# EAGLE design netCPU breakout (EAGLE 6.3)
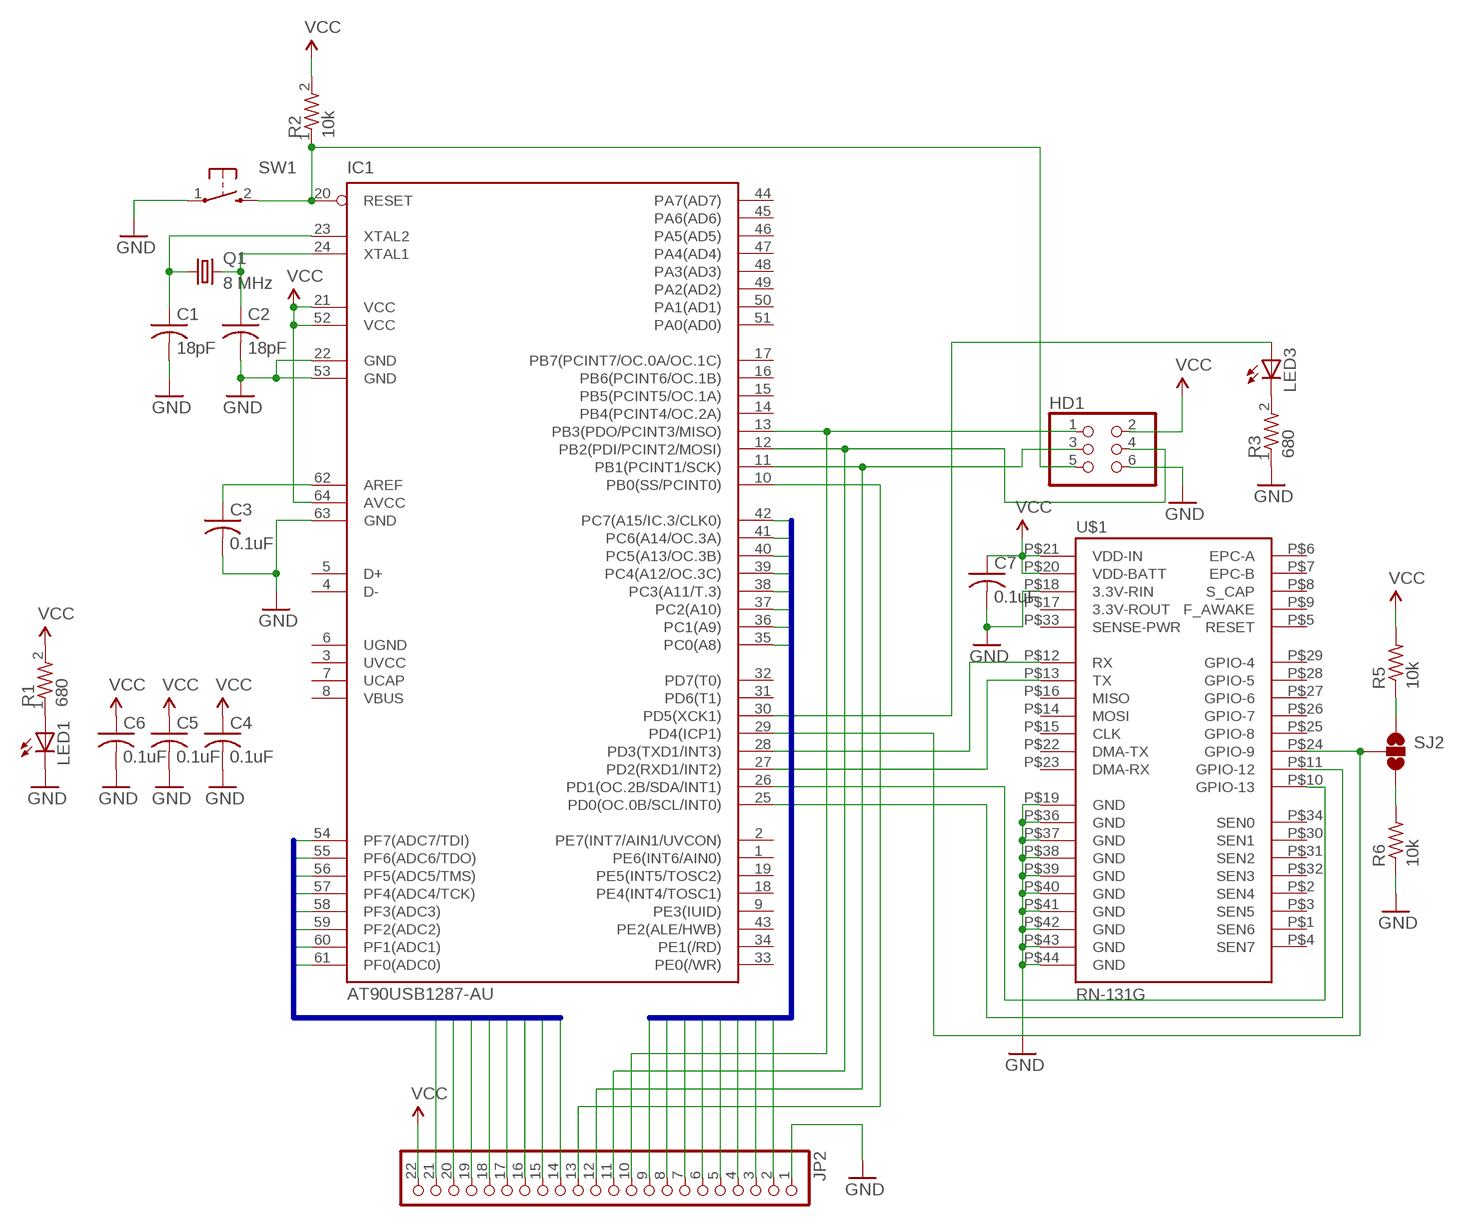
[diagram p0: schematic, sheet 1]

## Parts
C1  18pF  C-USC0603K  [C0603K]
C2  18pF  C-USC0603K  [C0603K]
C3  0.1uF  C-USC0603K  [C0603K]
C4  0.1uF  C-USC0603K  [C0603K]
C5  0.1uF  C-USC0603K  [C0603K]
C6  0.1uF  C-USC0603K  [C0603K]
C7  0.1uF  C-USC0603K  [C0603K]
HD1  HEADER2X3  [HEADER2X3]
IC1  AT90USB1287-AU  [TQFP64]
JP2  PINHD-1X22  [1X22]
LED1  LEDCHIP-LED0603  [CHIP-LED0603]
LED3  LEDCHIP-LED0603  [CHIP-LED0603]
Q1  8 MHz  CRYSTALHC49UP  [HC49UP]
R1  680  0603_RESISTOR  [0603_RESISTOR]
R2  10k  0603_RESISTOR  [0603_RESISTOR]
R3  680  0603_RESISTOR  [0603_RESISTOR]
R5  10k  R-US_R0603  [R0603]
R6  10k  R-US_R0603  [R0603]
SJ2  SOLDERJUMPER_2WAYPASTE2&3  [SJ_3_PASTE2&3]
SW1  TAC-SWITCH  [TAC-SWITCH]
U$1  RN-131G  [RN-131G]

## Nets
GND: C1.2 C2.2 C3.2 C4.2 C5.2 C6.2 C7.2 HD1.6 IC1.22(GND) IC1.53(GND) IC1.63(GND) JP2.1 LED1.C R3.1 R6.1 SW1.1 U$1.P$18(3.3V-RIN) U$1.P$19(GND) U$1.P$36(GND) U$1.P$37(GND) U$1.P$38(GND) U$1.P$39(GND) U$1.P$40(GND) U$1.P$41(GND) U$1.P$42(GND) U$1.P$43(GND) U$1.P$44(GND)
MISO: HD1.1 IC1.13(PB3(PDO/PCINT3/MISO)) JP2.10
MOSI: HD1.4 IC1.12(PB2(PDI/PCINT2/MOSI)) JP2.11
N$1: C1.1 IC1.23(XTAL2) Q1.1
N$2: C2.1 IC1.24(XTAL1) Q1.2
N$3: LED1.A R1.1
N$4: LED3.C R3.2
N$6: IC1.28(PD3(TXD1/INT3)) U$1.P$12(RX)
N$8: C3.1 IC1.62(AREF)
N$9: IC1.27(PD2(RXD1/INT2)) U$1.P$13(TX)
N$10: IC1.26(PD1(OC.2B/SDA/INT1)) U$1.P$10(GPIO-13)
N$11: IC1.25(PD0(OC.0B/SCL/INT0)) U$1.P$11(GPIO-12)
N$13: IC1.29(PD4(ICP1)) SJ2.2 U$1.P$24(GPIO-9)
N$15: IC1.30(PD5(XCK1)) LED3.A
N$17: R6.2 SJ2.3
N$18: R5.1 SJ2.1
PC0: IC1.35(PC0(A8)) JP2.2
PC1: IC1.36(PC1(A9)) JP2.3
PC2: IC1.37(PC2(A10)) JP2.4
PC3: IC1.38(PC3(A11/T.3)) JP2.5
PC4: IC1.39(PC4(A12/OC.3C)) JP2.6
PC5: IC1.40(PC5(A13/OC.3B)) JP2.7
PC6: IC1.41(PC6(A14/OC.3A)) JP2.8
PC7: IC1.42(PC7(A15/IC.3/CLK0)) JP2.9
PF0: IC1.61(PF0(ADC0)) JP2.14
PF1: IC1.60(PF1(ADC1)) JP2.15
PF2: IC1.59(PF2(ADC2)) JP2.16
PF3: IC1.58(PF3(ADC3)) JP2.17
PF4: IC1.57(PF4(ADC4/TCK)) JP2.18
PF5: IC1.56(PF5(ADC5/TMS)) JP2.19
PF6: IC1.55(PF6(ADC6/TDO)) JP2.20
PF7: IC1.54(PF7(ADC7/TDI)) JP2.21
RESET: HD1.5 IC1.20(RESET) R2.1 SW1.2
SCK: HD1.3 IC1.11(PB1(PCINT1/SCK)) JP2.12
SS: IC1.10(PB0(SS/PCINT0)) JP2.13
VCC: C4.1 C5.1 C6.1 C7.1 HD1.2 IC1.21(VCC) IC1.52(VCC) IC1.64(AVCC) JP2.22 R1.2 R2.2 R5.2 U$1.P$20(VDD-BATT) U$1.P$21(VDD-IN)
Unconnected: IC1.1(PE6(INT6/AIN0)) IC1.2(PE7(INT7/AIN1/UVCON)) IC1.4(D-) IC1.5(D+) IC1.9(PE3(IUID)) IC1.14(PB4(PCINT4/OC.2A)) IC1.15(PB5(PCINT5/OC.1A)) IC1.16(PB6(PCINT6/OC.1B)) IC1.17(PB7(PCINT7/OC.0A/OC.1C)) IC1.18(PE4(INT4/TOSC1)) IC1.19(PE5(INT5/TOSC2)) IC1.31(PD6(T1)) IC1.32(PD7(T0)) IC1.33(PE0(/WR)) IC1.34(PE1(/RD)) IC1.43(PE2(ALE/HWB)) IC1.44(PA7(AD7)) IC1.45(PA6(AD6)) IC1.46(PA5(AD5)) IC1.47(PA4(AD4)) IC1.48(PA3(AD3)) IC1.49(PA2(AD2)) IC1.50(PA1(AD1)) IC1.51(PA0(AD0)) U$1.P$1(SEN6) U$1.P$2(SEN4) U$1.P$3(SEN5) U$1.P$4(SEN7) U$1.P$5(RESET) U$1.P$6(EPC-A) U$1.P$7(EPC-B) U$1.P$8(S_CAP) U$1.P$9(F_AWAKE) U$1.P$14(MOSI) U$1.P$15(CLK) U$1.P$16(MISO) U$1.P$17(3.3V-ROUT) U$1.P$22(DMA-TX) U$1.P$23(DMA-RX) U$1.P$25(GPIO-8) U$1.P$26(GPIO-7) U$1.P$27(GPIO-6) U$1.P$28(GPIO-5) U$1.P$29(GPIO-4) U$1.P$30(SEN1) U$1.P$31(SEN2) U$1.P$32(SEN3) U$1.P$33(SENSE-PWR) U$1.P$34(SEN0)

## Buses
PF[0..7]
PC[0..7]

## Power pins joined to a net without a drawn wire
UCAP: IC1.7(UCAP)
UGND: IC1.6(UGND)
UVCC: IC1.3(UVCC)
VBUS: IC1.8(VBUS)

## Library data of the parts
C1-C7 = rcl:C-US: CAPACITOR, American symbol
HD1 = jkf-parts:HEADER2X3
IC1 = at90usb:AT90USB1287-*: Atmel AT90USB1287 AVR Microcontroller with USB Interface and 128kB Flash Memory
JP2 = pinhead:PINHD-1X22: PIN HEADER
LED1 LED3 = adafruit:LED: LED OSRAM: - CHIPLED LG R971, LG N971, LY N971, LG Q971, LY Q971, LO R971, LY R971 LH N974, LH R974 LS Q976, LO Q976, LY Q976 LO Q996 - Hyper CHIPLED LW Q18S LB Q993, LB Q99A, LB R99A - SideLED LS A670, LO A670, LY A670, LG A670, LP A670 LB A673, LV A673, LT A673, LW A673 LH A674 LY A675 LS A676, LA A676, LO A676, LY A676, LW A676 LS A679, LY A679, LG A679 - Hyper Micro SIDELED® LS Y876, LA Y876, LO Y876, LY Y876 LT Y87S - SmartLED LW L88C, LW L88S LB L89C, LB L89S, LG L890 LS L89K, LO L89K, LY L89K LS L896, LA L896, LO L896, LY L896 - TOPLED LS T670, LO T670, LY T670, LG T670, LP T670 LSG T670, LSP T670, LSY T670, LOP T670, LYG T670 LG T671, LOG T671, LSG T671 LB T673, LV T673, LT T673, LW T673 LH T674 LS T676, LA T676, LO T676, LY T676, LB T676, LH T676, LSB T676, LW T676 LB T67C, LV T67C, LT T67C, LS T67K, LO T67K, LY T67K, LW E67C LS E67B, LA E67B, LO E67B, LY E67B, LB E67C, LV E67C, LT E67C LW T67C LS T679, LY T679, LG T679 LS T770, LO T770, LY T770, LG T770, LP T770 LB T773, LV T773, LT T773, LW T773 LH T774 LS E675, LA E675, LY E675, LS T675 LS T776, LA T776, LO T776, LY T776, LB T776 LHGB T686 LT T68C, LB T68C - Hyper Mini TOPLED® LB M676 - Mini TOPLED Santana® LG M470 LS M47K, LO M47K, LY M47K Source: http://www.osram.convergy.de/
Q1 = crystal:CRYSTAL: CRYSTAL; OC_FARNELL: unknown; OC_NEWARK: unknown
R1-R3 = jkf-parts:0603_RESISTOR
R5 R6 = resistor:R-US_: RESISTOR, American symbol
SJ2 = SparkFun-Passives:SOLDERJUMPER_2WAY: Solder Jumper 2 way solder jumper
SW1 = jkf-parts:TAC-SWITCH
U$1 = SparkFun-RF:RN-131G: Roving Netowrks WiFLy GSX Module

## Board
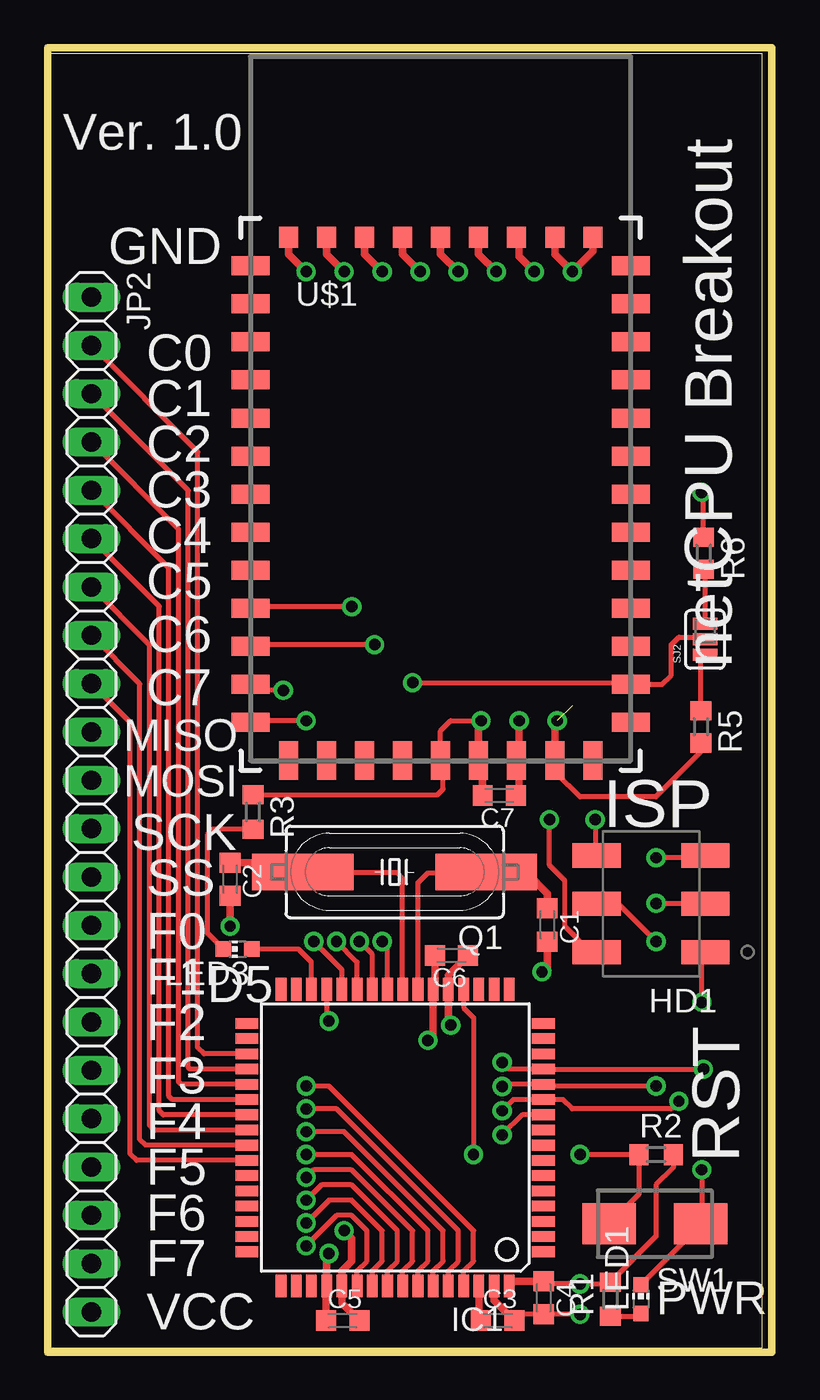
[diagram p1: board, top side]
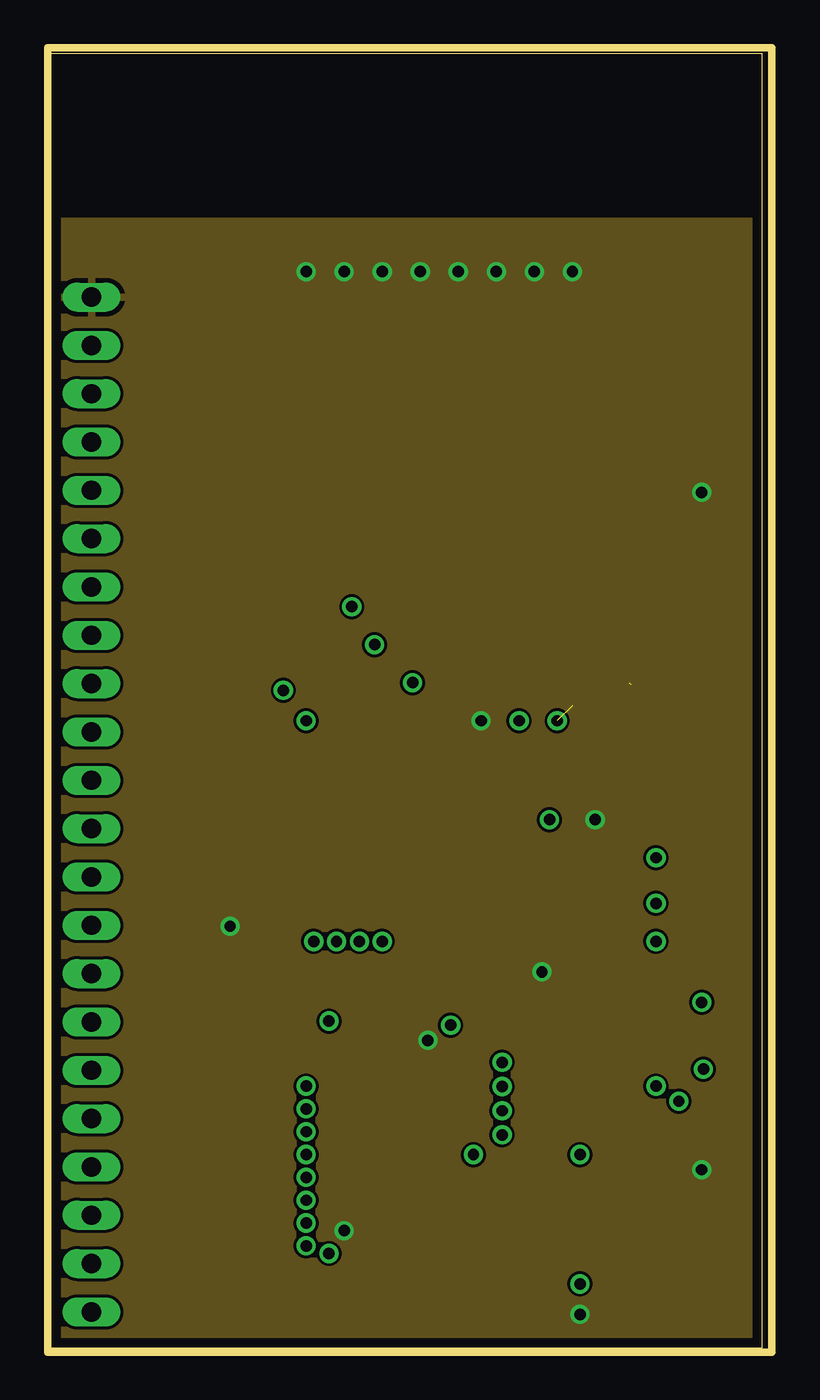
[diagram p2: board, inner layer GND]
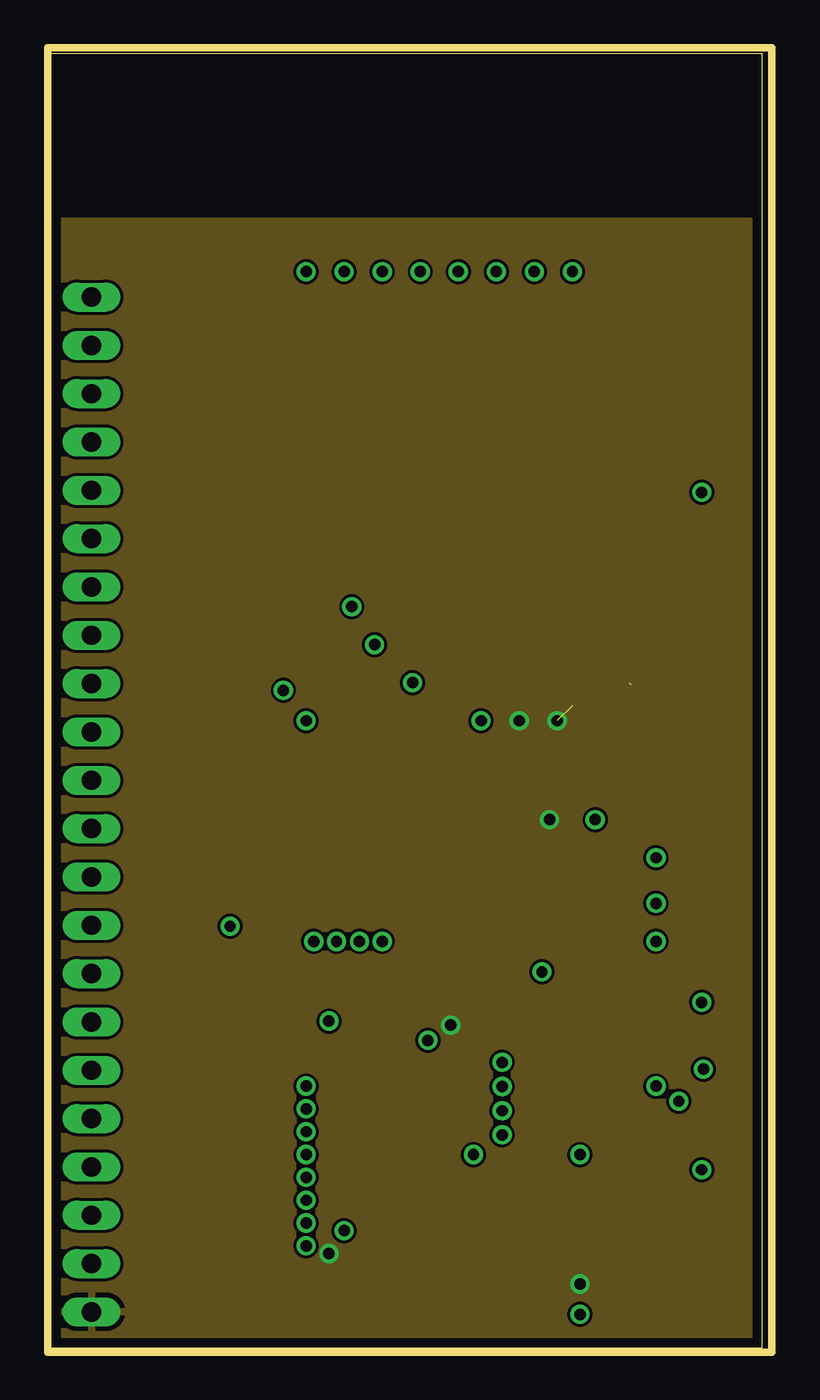
[diagram p3: board, inner layer VCC]
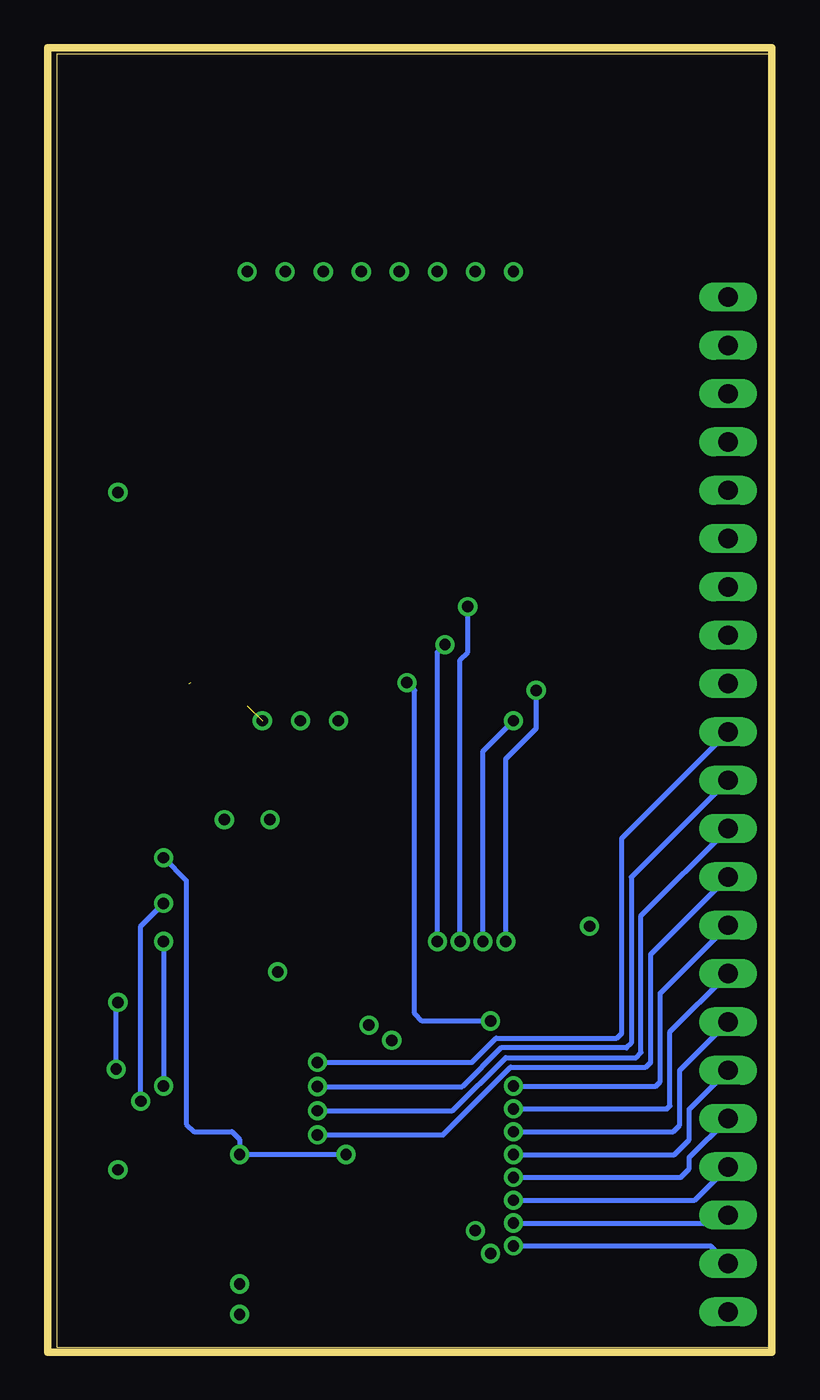
[diagram p4: board, bottom side, seen from below]

Size 38.1 x 68.58 mm. Coordinates in mm from the lower left corner, seen from the top.
Outline: 0.09,0.25 37.6,0.25 37.6,68.25 0.09,68.25 0.09,0.25
Outline: 0,68.58 38.1,68.58 38.1,0 0,0 0,68.58
Copper layers (1+2*15+16): Top 0.0178mm / dielectric 12mil / GND 0.0356mm / dielectric 28mil / VCC 0.0356mm / dielectric 12mil / Bottom 0.0178mm
Design rules "SSC-EAGLE-4Lyr_v1.0.0.3 *": minimum track width 6mil, minimum drill 8mil, track to track 6mil, track to pad 6mil, pad to pad 6mil, via to via 6mil, smd to smd 6mil, copper to edge 20mil, drill to drill 16mil, minimum pad ring 8mil, minimum via ring 8mil, stop-mask expansion 3mil, vias tented up to drill 0mil, thermal gap 10mil
tKeepout: area 14.5,32.9 to 16.7,35.1; area 23.3,38.1 to 25.5,40.3

### Footprints (pad centres in the part's own frame; a part is rotated, then mirrored left to right if it is on the bottom)
C0603K = smd 1.05 x 1.08: 1 -0.875,0; 2 0.875,0
HEADER2X3 = smd 2.54 x 1.27: 1 -3.175,2.54; 2 2.54,2.54; 3 -3.175,0; 4 2.54,0; 5 -3.175,-2.54; 6 2.54,-2.54
TQFP64 = smd 1.194 x 0.559: 1 -7.8,6; 2 -7.8,5.2; 3 -7.8,4.4; 4 -7.8,3.6; 5 -7.8,2.8; 6 -7.8,2; 7 -7.8,1.2; 8 -7.8,0.4; 9 -7.8,-0.4; 10 -7.8,-1.2; 11 -7.8,-2; 12 -7.8,-2.8; 13 -7.8,-3.6; 14 -7.8,-4.4; 15 -7.8,-5.2; 16 -7.8,-6; 33 7.8,-6; 34 7.8,-5.2; 35 7.8,-4.4; 36 7.8,-3.6; 37 7.8,-2.8; 38 7.8,-2; 39 7.8,-1.2; 40 7.8,-0.4; 41 7.8,0.4; 42 7.8,1.2; 43 7.8,2; 44 7.8,2.8; 45 7.8,3.6; 46 7.8,4.4; 47 7.8,5.2; 48 7.8,6 | smd 0.559 x 1.194: 17 -6,-7.8; 18 -5.2,-7.8; 19 -4.4,-7.8; 20 -3.6,-7.8; 21 -2.8,-7.8; 22 -2,-7.8; 23 -1.2,-7.8; 24 -0.4,-7.8; 25 0.4,-7.8; 26 1.2,-7.8; 27 2,-7.8; 28 2.8,-7.8; 29 3.6,-7.8; 30 4.4,-7.8; 31 5.2,-7.8; 32 6,-7.8; 49 6,7.8; 50 5.2,7.8; 51 4.4,7.8; 52 3.6,7.8; 53 2.8,7.8; 54 2,7.8; 55 1.2,7.8; 56 0.4,7.8; 57 -0.4,7.8; 58 -1.2,7.8; 59 -2,7.8; 60 -2.8,7.8; 61 -3.6,7.8; 62 -4.4,7.8; 63 -5.2,7.8; 64 -6,7.8
1X22 = drill 1.016 long: 1 -26.67,0; 2 -24.13,0; 3 -21.59,0; 4 -19.05,0; 5 -16.51,0; 6 -13.97,0; 7 -11.43,0; 8 -8.89,0; 9 -6.35,0; 10 -3.81,0; 11 -1.27,0; 12 1.27,0; 13 3.81,0; 14 6.35,0; 15 8.89,0; 16 11.43,0; 17 13.97,0; 18 16.51,0; 19 19.05,0; 20 21.59,0; 21 24.13,0; 22 26.67,0
CHIP-LED0603 = smd 0.8 x 0.8: A 0,-0.75; C 0,0.75
HC49UP = smd 5.334 x 1.93: 1 -4.826,0; 2 4.826,0
0603_RESISTOR = smd 1 x 1.1: 1 -0.9,0; 2 0.9,0
R0603 = smd 1 x 1.1: 1 -0.85,0; 2 0.85,0
SJ_3_PASTE2&3 = smd 0.635 x 1.27: 1 -0.813,0; 2 0,0; 3 0.813,0
TAC-SWITCH = smd 2.8 x 2.16: 1 1.4,1.08; 2 6.2,1.08
RN-131G = smd 2 x 1: P$1 -10,11; P$2 -10,9; P$3 -10,7; P$4 -10,5; P$5 -10,3; P$6 -10,1; P$7 -10,-1; P$8 -10,-3; P$9 -10,-5; P$10 -10,-7; P$11 -10,-9; P$12 -10,-11; P$13 -10,-13; P$23 10,-13; P$24 10,-11; P$25 10,-9; P$26 10,-7; P$27 10,-5; P$28 10,-3; P$29 10,-1; P$30 10,1; P$31 10,3; P$32 10,5; P$33 10,7; P$34 10,9; P$35 10,11 | smd 1 x 2: P$14 -8,-15; P$15 -6,-15; P$16 -4,-15; P$17 -2,-15; P$18 0,-15; P$19 2,-15; P$20 4,-15; P$21 6,-15; P$22 8,-15 | smd 1 x 1.11: P$36 8,12.492; P$37 6,12.492; P$38 4,12.492; P$39 2,12.492; P$40 0,12.492; P$41 -2,12.492; P$42 -4,12.492; P$43 -6,12.492; P$44 -8,12.492

### Placement (x,y rotation side)
C1  26.28,22.47 270 top
C2  9.6,24.87 270 top
C3  23.68,1.67 0 top
C4  26.09,2.87 270 top
C5  15.52,1.67 0 top
C6  21.24,20.87 180 top
C7  23.76,29.27 180 top
HD1  31.42,23.58 180 top
IC1  18.28,11.29 180 top
JP2  2.31,28.8 270 top
LED1  31.2,2.8 0 top
LED3  10,21.2 90 top
Q1  18.25,25.25 180 top
R1  29.6,2.8 90 top
R2  32,10.4 0 top
R3  10.8,28.4 270 top
R5  34.36,32.88 270 top
R6  34.5,42 270 top
SJ2  34.58,37.48 90 top
SW1  35.74,7.84 180 top
U$1  20.67,46.11 0 top

### Tracks (layer width: path | path; a pad name or v marks a point on that pad's centre or on a via)
GND  (via drill 0.6, 0.6 pad 0.25)
  Top 0.254: v34.4,9.6 34.4,6.82 SW1.1 34.34,6.69 LED1.C | v28.8,28 28.8,26.2 HD1.6 | v22.8,33.2 21.2,33.2 20.67,32.67 U$1.P$18 20.8,30.98 20.8,29.6 20.5,29.3 R3.1 | 24.89,2 24.89,1.31 | v28,2 C4.2 24.88,2 C3.2 | R6.1 34.5,45.1 v34.4,45.2
  Top 0.406: U$1.P$44 12.67,57.73 v13.6,56.8 | U$1.P$43 14.67,57.73 v15.6,56.8 | U$1.P$42 16.67,57.73 v17.6,56.8 | U$1.P$41 18.67,57.73 v19.6,56.8 | U$1.P$40 20.67,57.73 v21.6,56.8 | U$1.P$39 22.67,57.73 v23.6,56.8 | U$1.P$38 24.67,58.53 24.8,58.4 24.8,57.6 v25.6,56.8 | U$1.P$36 28.67,57.87 v27.6,56.8 26.67,57.73 U$1.P$37 | v22.8,33.2 22.67,33.07 U$1.P$19 22.89,30.89 C7.2 | C2.2 v9.6,22.4 | v15.6,6.4 16,6 16,4.8 15.48,4.28 IC1.53 15.48,2.58 C5.2 | 24.89,2 C3.2 23.48,2.75 IC1.63 | C6.2 20.36,19.18 IC1.22 20.28,16.68 v20,16.4 | C1.2 26.28,20.28 v26,20
  pour GND: 0.09,59.45 37.56,59.45 37.56,0.25 0.09,0.25
MISO  (via drill 0.6 pad 0.25, 0.6 pad 0.41)
  Top 0.254: v34.49,14.89 IC1.13 24.26,14.89 v23.91,15.24 | 34.4,20.84 HD1.1 34.59,21 34.4,20.8 v34.4,18.4
  Bottom 0.254: v34.49,14.89 34.49,18.31 v34.4,18.4 | v23.91,15.24 15.78,15.24 14.51,16.51 8.16,16.51 7.91,16.77 7.91,27.02 JP2.10
MOSI  (via drill 0.6 pad 0.25, 0.6 pad 0.41)
  Top 0.254: 28.9,23.6 HD1.4 30.02,23.58 v32,21.6 | v32,14 26.17,14 IC1.12 | IC1.12 25.94,14.23 | IC1.12 24.02,14.09 v23.91,13.97
  Bottom 0.254: v32,21.6 v32,14 | JP2.11 7.4,24.98 7.4,16.26 7.65,16.01 14.26,16.01 16.29,13.97 v23.91,13.97
N$1
  Top 0.254: 23.57,25.75 Q1.1 23.03,25.2 20,25.2 19.48,24.68 IC1.23
  Top 0.406: C1.1 26.28,24.12 25.2,25.2 24.12,25.2 23.57,25.75
N$2
  Top 0.254: 12.93,25.75 Q1.2 13.47,25.2 18.4,25.2 18.68,24.92 IC1.24
  Top 0.406: C2.1 12.93,25.75
N$3
  Top 0.254: R1.1 31.2,1.9 LED1.A
N$4
  Top 0.254: R3.2 8.7,27.5 8.4,27.2 8.4,22.05 LED3.C
N$6  (via drill 0.6 pad 0.41)
  Top 0.254: IC1.28 15.48,20.12 v14,21.6 | v12.4,34.8 10.98,34.8 U$1.P$12
  Bottom 0.254: v14,21.6 14,31.2 12.4,32.8 v12.4,34.8
N$8
  Top 0.406: IC1.62 22.68,1.79 C3.1
N$9  (via drill 0.6 pad 0.41)
  Top 0.254: IC1.27 16.28,20.52 v15.2,21.6 | v13.6,33.2 10.76,33.2 U$1.P$13
  Bottom 0.254: v15.2,21.6 15.2,31.6 v13.6,33.2
N$10  (via drill 0.6 pad 0.41)
  Top 0.254: IC1.26 17.08,20.92 v16.4,21.6 | v16,39.2 10.76,39.2 U$1.P$10
  Bottom 0.254: v16.4,21.6 16.4,36.4 16,36.8 v16,39.2
N$11  (via drill 0.6 pad 0.41)
  Top 0.254: IC1.25 17.88,21.32 v17.6,21.6 | v17.2,37.2 10.76,37.2 U$1.P$11
  Bottom 0.254: v17.6,21.6 17.6,36.8 v17.2,37.2
N$13  (via drill 0.6 pad 0.41)  (1 unrouted)
  Top 0.254: IC1.29 14.68,17.54 v14.8,17.42 | v19.2,35.2 30.58,35.2 | U$1.P$24 32.31,35.11 32.8,35.6 32.8,37.2 33.2,37.6 34.46,37.6 SJ2.2
  Bottom 0.254: v14.8,17.42 18.4,17.42 18.8,17.82 18.8,34.8 v19.2,35.2
N$15
  Top 0.254: IC1.30 13.88,20.52 13.2,21.2 LED3.A
N$17
  Top 0.254: SJ2.3 34.58,41.07 R6.2
N$18
  Top 0.254: R5.1 34.36,36.45 SJ2.1
PC0
  Top 0.254: IC1.35 8.22,15.69 7.91,16.01 7.91,47.34 JP2.2
PC1
  Top 0.254: IC1.36 7.5,14.89 7.4,14.99 7.4,45.3 JP2.3
PC2
  Top 0.254: IC1.37 7.03,14.09 6.89,14.23 6.89,43.27 JP2.4
PC3
  Top 0.254: IC1.38 6.56,13.29 6.38,13.47 6.38,41.24 JP2.5
PC4
  Top 0.254: IC1.39 6.09,12.49 5.87,12.7 5.87,39.21 JP2.6
PC5
  Top 0.254: IC1.40 5.62,11.69 5.37,11.94 5.37,37.18 JP2.7
PC6
  Top 0.254: IC1.41 5.15,10.89 4.86,11.18 4.86,35.14 JP2.8
PC7
  Top 0.254: IC1.42 4.68,10.09 4.35,10.42 4.35,33.11 JP2.9
PF0  (via drill 0.6 pad 0.25)
  Top 0.254: IC1.61 21.88,4.28 22.4,4.8 22.4,6.4 14.8,14 v13.6,14
  Bottom 0.254: v13.6,14 6.1,14 5.87,14.23 5.87,18.89 JP2.14
PF1  (via drill 0.6 pad 0.25)
  Top 0.254: IC1.60 21.08,4.28 21.6,4.8 21.6,6.4 15.2,12.8 v13.6,12.8
  Bottom 0.254: v13.6,12.8 5.52,12.8 5.37,12.96 5.37,16.86 JP2.15
PF2  (via drill 0.6 pad 0.25)
  Top 0.254: IC1.59 20.28,4.28 20.8,4.8 20.8,6.4 15.6,11.6 v13.6,11.6
  Bottom 0.254: v13.6,11.6 5.2,11.6 4.86,11.94 4.86,14.82 JP2.16
PF3  (via drill 0.6 pad 0.25)
  Top 0.254: IC1.58 19.48,4.28 20,4.8 20,6.4 16,10.4 v13.6,10.4
  Bottom 0.254: v13.6,10.4 5.13,10.4 4.35,11.18 4.35,12.79 JP2.17
PF4  (via drill 0.6 pad 0.25)
  Top 0.254: IC1.57 18.68,4.28 19.2,4.8 19.2,6.4 16,9.6 14,9.6 v13.6,9.2
  Bottom 0.254: v13.6,9.2 4.81,9.2 4.35,9.66 4.35,10.25 JP2.18
PF5  (via drill 0.6 pad 0.25)
  Top 0.254: IC1.56 17.88,4.28 18.4,4.8 18.4,6.4 16,8.8 14.4,8.8 v13.6,8
  Bottom 0.254: v13.6,8 4.06,8 JP2.19
PF6  (via drill 0.6 pad 0.25)
  Top 0.254: IC1.55 17.08,4.28 17.6,4.8 17.6,6.4 16,8 14.8,8 v13.6,6.8
  Bottom 0.254: v13.6,6.8 2.72,6.8 JP2.20
PF7  (via drill 0.6 pad 0.25)
  Top 0.254: IC1.54 16.28,4.28 16.8,4.8 16.8,6.4 16,7.2 15.2,7.2 v13.6,5.6
  Bottom 0.254: v13.6,5.6 3.24,5.6 JP2.21
RESET  (via drill 0.6 pad 0.25, 0.6 pad 0.41)
  Top 0.254: HD1.5 34.48,26 v32,26 | 29.88,7.1 SW1.2 31.1,8.32 R2.1 v28,10.4 | IC1.20 21.88,18.12 22.4,17.6 v22.4,10.4
  Bottom 0.254: v22.4,10.4 v28,10.4 28,11.2 28.4,11.6 30.4,11.6 30.8,12 30.8,24.8 v32,26
SCK  (via drill 0.6 pad 0.25, 0.6 pad 0.41)
  Top 0.254: v32,23.6 34.58,23.6 HD1.3 | v33.2,13.2 32.8,12.8 27.6,12.8 27.11,13.29 IC1.11 24.49,13.29 v23.91,12.7
  Bottom 0.254: v33.2,13.2 33.2,22.4 v32,23.6 | v23.91,12.7 16.8,12.7 14,15.5 7.14,15.5 6.89,15.75 6.89,22.95 JP2.12
SS  (via drill 0.6 pad 0.25)
  Top 0.254: IC1.10 24.96,12.49 v23.91,11.43
  Bottom 0.254: v23.91,11.43 17.3,11.43 13.75,14.99 6.64,14.99 6.38,15.24 6.38,20.92 JP2.13
VCC  (via drill 0.6 pad 0.25)  (1 unrouted)
  Top 0.254: IC1.64 24.28,3.72 | HD1.2 28.56,21.04 27.2,22.4 27.2,24.8 26.4,25.6 v26.4,28 | C4.1 26.24,3.6 v28,3.6 29.6,3.6 R1.2 32,6.1 32,8.8 32.9,9.7 R2.2 | R5.2 34.36,31.56 32,29.2 28,29.2 26.8,30.4 26.8,30.98 U$1.P$21
  Top 0.406: v24.8,33.2 24.8,31.11 U$1.P$20 24.8,30.98 24.8,29.6 24.64,29.43 C7.1 | U$1.P$21 26.67,33.07 v26.8,33.2 | v14.8,5.2 14.68,5.08 IC1.52 14.64,3.46 C5.1 | C4.1 24.54,3.75 IC1.64 | C6.1 21.08,19.84 IC1.21 21.08,17.32 v21.2,17.2
  pour VCC: 0.09,59.45 37.56,59.45 37.56,0.25 0.09,0.25

### Text on the board
tSilk: Ver. 1.0 | GND | C0 | C1 | C2 | C3 | C4 | C5 | C6 | netCPU Breakout | C7 | MISO | MOSI | ISP | SCK | SS | F0 | F1 | D5 | F2 | F3 | F4 | RST | F5 | F6 | F7 | PWR | VCC